# EasyEDA schematic SCH_prototypeCarbon_2025-07-03.json
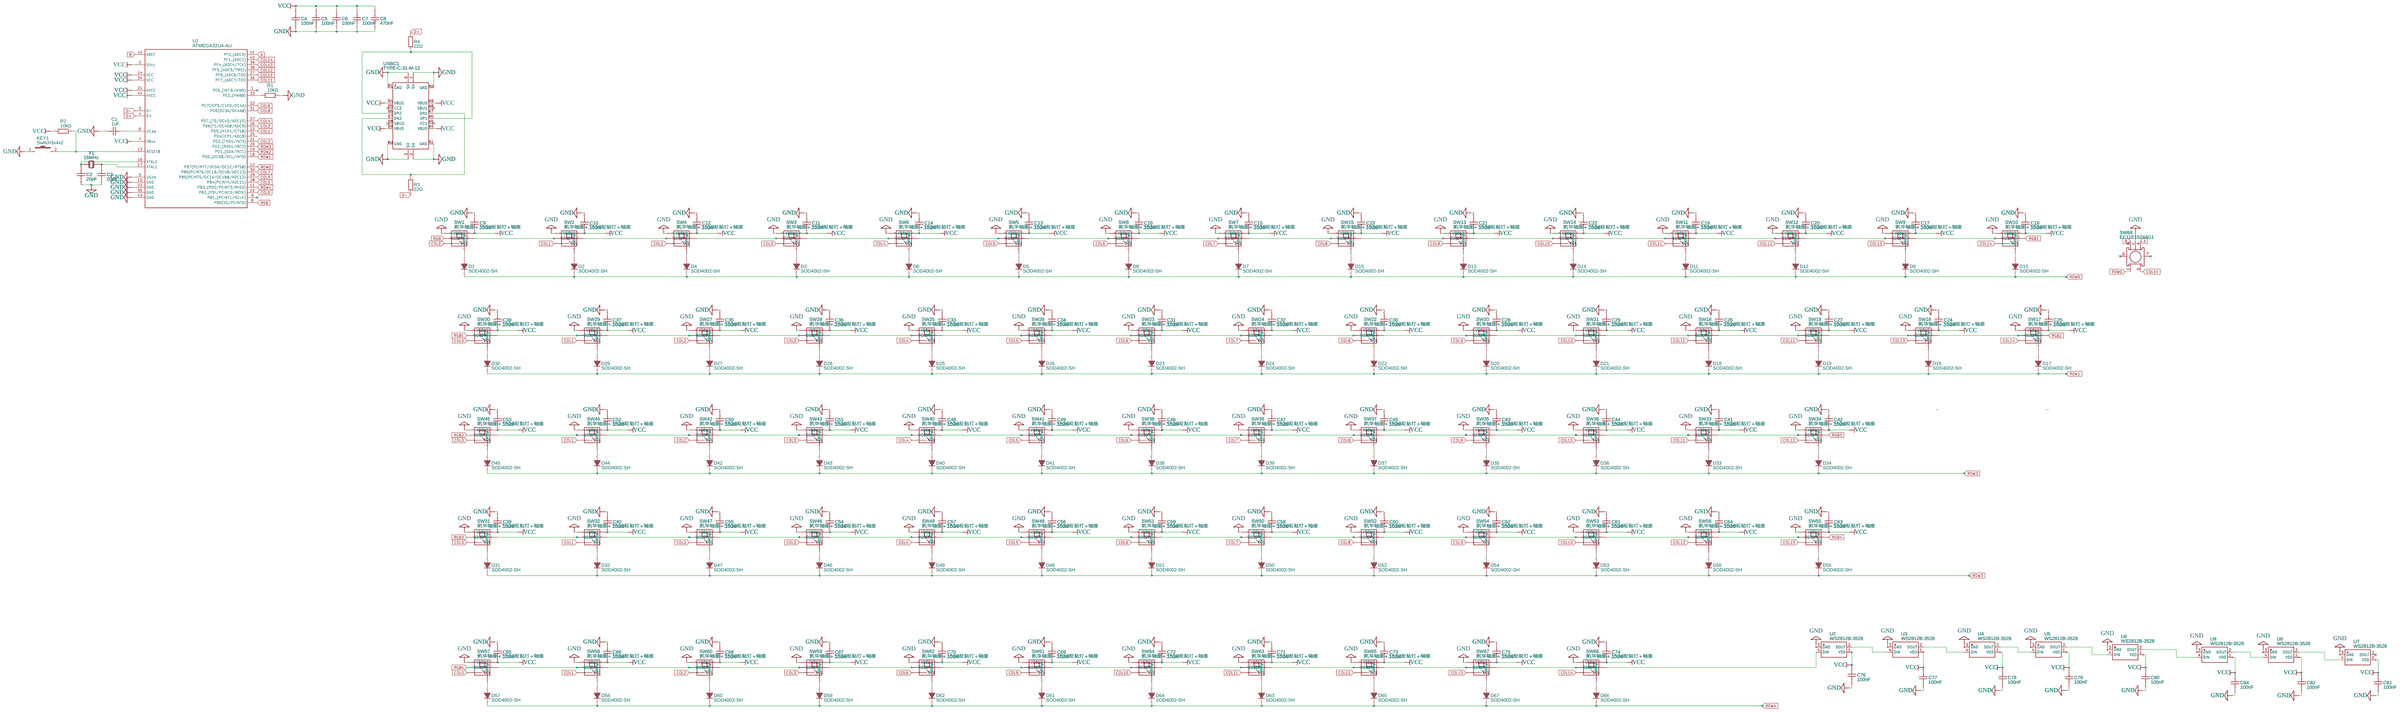
[diagram p0: schematic sheet]

## Parts
C1  1uF  [C0805]
C2  20pF  [C0805]
C3  20pF  [C0805]
C4  100nF  [C0805]
C5  100nF  [C0805]
C6  100nF  [C0805]
C7  100nF  [C0805]
C8  470nF  [C0805]
C9  100nF  [C0805]
C10  100nF  [C0805]
C11  100nF  [C0805]
C12  100nF  [C0805]
C13  100nF  [C0805]
C14  100nF  [C0805]
C15  100nF  [C0805]
C16  100nF  [C0805]
C17  100nF  [C0805]
C18  100nF  [C0805]
C19  100nF  [C0805]
C20  100nF  [C0805]
C21  100nF  [C0805]
C22  100nF  [C0805]
C23  100nF  [C0805]
C24  100nF  [C0805]
C25  100nF  [C0805]
C26  100nF  [C0805]
C27  100nF  [C0805]
C28  100nF  [C0805]
C29  100nF  [C0805]
C30  100nF  [C0805]
C31  100nF  [C0805]
C32  100nF  [C0805]
C33  100nF  [C0805]
C34  100nF  [C0805]
C35  100nF  [C0805]
C36  100nF  [C0805]
C37  100nF  [C0805]
C38  100nF  [C0805]
C39  100nF  [C0805]
C40  100nF  [C0805]
C41  100nF  [C0805]
C42  100nF  [C0805]
C43  100nF  [C0805]
C44  100nF  [C0805]
C45  100nF  [C0805]
C46  100nF  [C0805]
C47  100nF  [C0805]
C48  100nF  [C0805]
C49  100nF  [C0805]
C50  100nF  [C0805]
C51  100nF  [C0805]
C52  100nF  [C0805]
C53  100nF  [C0805]
C54  100nF  [C0805]
C55  100nF  [C0805]
C56  100nF  [C0805]
C57  100nF  [C0805]
C58  100nF  [C0805]
C59  100nF  [C0805]
C60  100nF  [C0805]
C61  100nF  [C0805]
C62  100nF  [C0805]
C63  100nF  [C0805]
C64  100nF  [C0805]
C65  100nF  [C0805]
C66  100nF  [C0805]
C67  100nF  [C0805]
C68  100nF  [C0805]
C69  100nF  [C0805]
C70  100nF  [C0805]
C71  100nF  [C0805]
C72  100nF  [C0805]
C73  100nF  [C0805]
C74  100nF  [C0805]
C75  100nF  [C0805]
C76  100nF  [C0805]
C77  100nF  [C0805]
C78  100nF  [C0805]
C79  100nF  [C0805]
C80  100nF  [C0805]
C81  100nF  [C0805]
C82  100nF  [C0805]
C84  100nF  [C0805]
D1  SOD4002-SH  [SOD-123F_L2.8-W1.8-LS3.7-RD]
D2  SOD4002-SH  [SOD-123F_L2.8-W1.8-LS3.7-RD]
D3  SOD4002-SH  [SOD-123F_L2.8-W1.8-LS3.7-RD]
D4  SOD4002-SH  [SOD-123F_L2.8-W1.8-LS3.7-RD]
D5  SOD4002-SH  [SOD-123F_L2.8-W1.8-LS3.7-RD]
D6  SOD4002-SH  [SOD-123F_L2.8-W1.8-LS3.7-RD]
D7  SOD4002-SH  [SOD-123F_L2.8-W1.8-LS3.7-RD]
D8  SOD4002-SH  [SOD-123F_L2.8-W1.8-LS3.7-RD]
D9  SOD4002-SH  [SOD-123F_L2.8-W1.8-LS3.7-RD]
D10  SOD4002-SH  [SOD-123F_L2.8-W1.8-LS3.7-RD]
D11  SOD4002-SH  [SOD-123F_L2.8-W1.8-LS3.7-RD]
D12  SOD4002-SH  [SOD-123F_L2.8-W1.8-LS3.7-RD]
D13  SOD4002-SH  [SOD-123F_L2.8-W1.8-LS3.7-RD]
D14  SOD4002-SH  [SOD-123F_L2.8-W1.8-LS3.7-RD]
D15  SOD4002-SH  [SOD-123F_L2.8-W1.8-LS3.7-RD]
D16  SOD4002-SH  [SOD-123F_L2.8-W1.8-LS3.7-RD]
D17  SOD4002-SH  [SOD-123F_L2.8-W1.8-LS3.7-RD]
D18  SOD4002-SH  [SOD-123F_L2.8-W1.8-LS3.7-RD]
D19  SOD4002-SH  [SOD-123F_L2.8-W1.8-LS3.7-RD]
D20  SOD4002-SH  [SOD-123F_L2.8-W1.8-LS3.7-RD]
D21  SOD4002-SH  [SOD-123F_L2.8-W1.8-LS3.7-RD]
D22  SOD4002-SH  [SOD-123F_L2.8-W1.8-LS3.7-RD]
D23  SOD4002-SH  [SOD-123F_L2.8-W1.8-LS3.7-RD]
D24  SOD4002-SH  [SOD-123F_L2.8-W1.8-LS3.7-RD]
D25  SOD4002-SH  [SOD-123F_L2.8-W1.8-LS3.7-RD]
D26  SOD4002-SH  [SOD-123F_L2.8-W1.8-LS3.7-RD]
D27  SOD4002-SH  [SOD-123F_L2.8-W1.8-LS3.7-RD]
D28  SOD4002-SH  [SOD-123F_L2.8-W1.8-LS3.7-RD]
D29  SOD4002-SH  [SOD-123F_L2.8-W1.8-LS3.7-RD]
D30  SOD4002-SH  [SOD-123F_L2.8-W1.8-LS3.7-RD]
D31  SOD4002-SH  [SOD-123F_L2.8-W1.8-LS3.7-RD]
D32  SOD4002-SH  [SOD-123F_L2.8-W1.8-LS3.7-RD]
D33  SOD4002-SH  [SOD-123F_L2.8-W1.8-LS3.7-RD]
D34  SOD4002-SH  [SOD-123F_L2.8-W1.8-LS3.7-RD]
D35  SOD4002-SH  [SOD-123F_L2.8-W1.8-LS3.7-RD]
D36  SOD4002-SH  [SOD-123F_L2.8-W1.8-LS3.7-RD]
D37  SOD4002-SH  [SOD-123F_L2.8-W1.8-LS3.7-RD]
D38  SOD4002-SH  [SOD-123F_L2.8-W1.8-LS3.7-RD]
D39  SOD4002-SH  [SOD-123F_L2.8-W1.8-LS3.7-RD]
D40  SOD4002-SH  [SOD-123F_L2.8-W1.8-LS3.7-RD]
D41  SOD4002-SH  [SOD-123F_L2.8-W1.8-LS3.7-RD]
D42  SOD4002-SH  [SOD-123F_L2.8-W1.8-LS3.7-RD]
D43  SOD4002-SH  [SOD-123F_L2.8-W1.8-LS3.7-RD]
D44  SOD4002-SH  [SOD-123F_L2.8-W1.8-LS3.7-RD]
D45  SOD4002-SH  [SOD-123F_L2.8-W1.8-LS3.7-RD]
D46  SOD4002-SH  [SOD-123F_L2.8-W1.8-LS3.7-RD]
D47  SOD4002-SH  [SOD-123F_L2.8-W1.8-LS3.7-RD]
D48  SOD4002-SH  [SOD-123F_L2.8-W1.8-LS3.7-RD]
D49  SOD4002-SH  [SOD-123F_L2.8-W1.8-LS3.7-RD]
D50  SOD4002-SH  [SOD-123F_L2.8-W1.8-LS3.7-RD]
D51  SOD4002-SH  [SOD-123F_L2.8-W1.8-LS3.7-RD]
D52  SOD4002-SH  [SOD-123F_L2.8-W1.8-LS3.7-RD]
D53  SOD4002-SH  [SOD-123F_L2.8-W1.8-LS3.7-RD]
D54  SOD4002-SH  [SOD-123F_L2.8-W1.8-LS3.7-RD]
D55  SOD4002-SH  [SOD-123F_L2.8-W1.8-LS3.7-RD]
D56  SOD4002-SH  [SOD-123F_L2.8-W1.8-LS3.7-RD]
D57  SOD4002-SH  [SOD-123F_L2.8-W1.8-LS3.7-RD]
D58  SOD4002-SH  [SOD-123F_L2.8-W1.8-LS3.7-RD]
D59  SOD4002-SH  [SOD-123F_L2.8-W1.8-LS3.7-RD]
D60  SOD4002-SH  [SOD-123F_L2.8-W1.8-LS3.7-RD]
D61  SOD4002-SH  [SOD-123F_L2.8-W1.8-LS3.7-RD]
D62  SOD4002-SH  [SOD-123F_L2.8-W1.8-LS3.7-RD]
D63  SOD4002-SH  [SOD-123F_L2.8-W1.8-LS3.7-RD]
D64  SOD4002-SH  [SOD-123F_L2.8-W1.8-LS3.7-RD]
D65  SOD4002-SH  [SOD-123F_L2.8-W1.8-LS3.7-RD]
D66  SOD4002-SH  [SOD-123F_L2.8-W1.8-LS3.7-RD]
D67  SOD4002-SH  [SOD-123F_L2.8-W1.8-LS3.7-RD]
KEY1  Switch3x4x2  [SW-SMD_L4.0-W2.9-LS5.0]
R1  10kΩ  [R0805]
R2  10kΩ  [R0805]
R3  22Ω  [R0805]
R4  22Ω  [R0805]
SW1  凯华轴座+3528反贴灯+轴座  [凯华轴座+3528反贴灯]
SW2  凯华轴座+3528反贴灯+轴座  [凯华轴座+3528反贴灯]
SW3  凯华轴座+3528反贴灯+轴座  [凯华轴座+3528反贴灯]
SW4  凯华轴座+3528反贴灯+轴座  [凯华轴座+3528反贴灯]
SW5  凯华轴座+3528反贴灯+轴座  [凯华轴座+3528反贴灯]
SW6  凯华轴座+3528反贴灯+轴座  [凯华轴座+3528反贴灯]
SW7  凯华轴座+3528反贴灯+轴座  [凯华轴座+3528反贴灯]
SW8  凯华轴座+3528反贴灯+轴座  [凯华轴座+3528反贴灯]
SW9  凯华轴座+3528反贴灯+轴座  [凯华轴座+3528反贴灯]
SW10  凯华轴座+3528反贴灯+轴座  [凯华轴座+3528反贴灯]
SW11  凯华轴座+3528反贴灯+轴座  [凯华轴座+3528反贴灯]
SW12  凯华轴座+3528反贴灯+轴座  [凯华轴座+3528反贴灯]
SW13  凯华轴座+3528反贴灯+轴座  [凯华轴座+3528反贴灯]
SW14  凯华轴座+3528反贴灯+轴座  [凯华轴座+3528反贴灯]
SW15  凯华轴座+3528反贴灯+轴座  [凯华轴座+3528反贴灯]
SW16  凯华轴座+3528反贴灯+轴座  [凯华轴座+3528反贴灯]
SW17  凯华轴座+3528反贴灯+轴座  [凯华轴座+3528反贴灯]
SW18  凯华轴座+3528反贴灯+轴座  [凯华轴座+3528反贴灯]
SW19  凯华轴座+3528反贴灯+轴座  [凯华轴座+3528反贴灯]
SW20  凯华轴座+3528反贴灯+轴座  [凯华轴座+3528反贴灯]
SW21  凯华轴座+3528反贴灯+轴座  [凯华轴座+3528反贴灯]
SW22  凯华轴座+3528反贴灯+轴座  [凯华轴座+3528反贴灯]
SW23  凯华轴座+3528反贴灯+轴座  [凯华轴座+3528反贴灯]
SW24  凯华轴座+3528反贴灯+轴座  [凯华轴座+3528反贴灯]
SW25  凯华轴座+3528反贴灯+轴座  [凯华轴座+3528反贴灯]
SW26  凯华轴座+3528反贴灯+轴座  [凯华轴座+3528反贴灯]
SW27  凯华轴座+3528反贴灯+轴座  [凯华轴座+3528反贴灯]
SW28  凯华轴座+3528反贴灯+轴座  [凯华轴座+3528反贴灯]
SW29  凯华轴座+3528反贴灯+轴座  [凯华轴座+3528反贴灯]
SW30  凯华轴座+3528反贴灯+轴座  [凯华轴座+3528反贴灯]
SW31  凯华轴座+3528反贴灯+轴座  [凯华轴座+3528反贴灯]
SW32  凯华轴座+3528反贴灯+轴座  [凯华轴座+3528反贴灯]
SW33  凯华轴座+3528反贴灯+轴座  [凯华轴座+3528反贴灯]
SW34  凯华轴座+3528反贴灯+轴座  [凯华轴座+3528反贴灯]
SW35  凯华轴座+3528反贴灯+轴座  [凯华轴座+3528反贴灯]
SW36  凯华轴座+3528反贴灯+轴座  [凯华轴座+3528反贴灯]
SW37  凯华轴座+3528反贴灯+轴座  [凯华轴座+3528反贴灯]
SW38  凯华轴座+3528反贴灯+轴座  [凯华轴座+3528反贴灯]
SW39  凯华轴座+3528反贴灯+轴座  [凯华轴座+3528反贴灯]
SW40  凯华轴座+3528反贴灯+轴座  [凯华轴座+3528反贴灯]
SW41  凯华轴座+3528反贴灯+轴座  [凯华轴座+3528反贴灯]
SW42  凯华轴座+3528反贴灯+轴座  [凯华轴座+3528反贴灯]
SW43  凯华轴座+3528反贴灯+轴座  [凯华轴座+3528反贴灯]
SW44  凯华轴座+3528反贴灯+轴座  [凯华轴座+3528反贴灯]
SW45  凯华轴座+3528反贴灯+轴座  [凯华轴座+3528反贴灯]
SW46  凯华轴座+3528反贴灯+轴座  [凯华轴座+3528反贴灯]
SW47  凯华轴座+3528反贴灯+轴座  [凯华轴座+3528反贴灯]
SW48  凯华轴座+3528反贴灯+轴座  [凯华轴座+3528反贴灯]
SW49  凯华轴座+3528反贴灯+轴座  [凯华轴座+3528反贴灯]
SW50  凯华轴座+3528反贴灯+轴座  [凯华轴座+3528反贴灯]
SW51  凯华轴座+3528反贴灯+轴座  [凯华轴座+3528反贴灯]
SW52  凯华轴座+3528反贴灯+轴座  [凯华轴座+3528反贴灯]
SW53  凯华轴座+3528反贴灯+轴座  [凯华轴座+3528反贴灯]
SW54  凯华轴座+3528反贴灯+轴座  [凯华轴座+3528反贴灯]
SW55  凯华轴座+3528反贴灯+轴座  [凯华轴座+3528反贴灯]
SW56  凯华轴座+3528反贴灯+轴座  [凯华轴座+3528反贴灯]
SW57  凯华轴座+3528反贴灯+轴座  [凯华轴座+3528反贴灯]
SW58  凯华轴座+3528反贴灯+轴座  [凯华轴座+3528反贴灯]
SW59  凯华轴座+3528反贴灯+轴座  [凯华轴座+3528反贴灯]
SW60  凯华轴座+3528反贴灯+轴座  [凯华轴座+3528反贴灯]
SW61  凯华轴座+3528反贴灯+轴座  [凯华轴座+3528反贴灯]
SW62  凯华轴座+3528反贴灯+轴座  [凯华轴座+3528反贴灯]
SW63  凯华轴座+3528反贴灯+轴座  [凯华轴座+3528反贴灯]
SW64  凯华轴座+3528反贴灯+轴座  [凯华轴座+3528反贴灯]
SW65  凯华轴座+3528反贴灯+轴座  [凯华轴座+3528反贴灯]
SW66  凯华轴座+3528反贴灯+轴座  [凯华轴座+3528反贴灯]
SW67  凯华轴座+3528反贴灯+轴座  [凯华轴座+3528反贴灯]
SW68  EC11E15244G1  [SW-TH_EC11E15244G1GAI]
U1  ATMEGA32U4-AU  [QFP-44_L10.0-W10.0-P0.80-LS13.2-BL]
U2  WS2812B-3528  [WS2812B-3528]
U3  WS2812B-3528  [WS2812B-3528]
U4  WS2812B-3528  [WS2812B-3528]
U5  WS2812B-3528  [WS2812B-3528]
U6  WS2812B-3528  [WS2812B-3528]
U7  WS2812B-3528  [WS2812B-3528]
U8  WS2812B-3528  [WS2812B-3528]
U9  WS2812B-3528  [WS2812B-3528]
USBC1  TYPE-C-31-M-12  [USB-C_SMD-TYPE-C-31-M-12]
X1  16MHz  [OSC-SMD_2P-L5.0-W3.2]

## Library data of the parts
C1 = TCC0805X7R105K250FTA: Contributor: LCSC; Supplier: LCSC; Supplier Part: C282735; Manufacturer: CCTC(三环); JLCPCB Part Class: Extended Part
C2 C3 = CC0805JRNPO0BN200: Contributor: LCSC; Supplier: LCSC; Supplier Part: C326845; Manufacturer: YAGEO(国巨); JLCPCB Part Class: Extended Part
C4-C7 C9-C82 C84 = CC0805KRX7R7BB104: Contributor: LCSC; Supplier: LCSC; Supplier Part: C519980; Manufacturer: YAGEO(国巨); JLCPCB Part Class: Extended Part
C8 = CC0805KKX7R0BB474: Contributor: LCSC; Supplier: LCSC; Supplier Part: C596323; Manufacturer: YAGEO(国巨); JLCPCB Part Class: Extended Part
D1-D67 = SOD4002-SH: Contributor: LCSC; Supplier: LCSC; Manufacturer: LRC(乐山无线电); Supplier Part: C154996; JLCPCB Part Class: Extended Part
KEY1 = Switch3x4x2: Supplier: LCSC; Manufacturer: 国产; Manufacturer Part: 轻触开关3x4x2; Supplier Part: C26638; JLCPCB Part Class: Extended Part
R1 R2 = AF0805FR-0710KL: Contributor: LCSC; Supplier: LCSC; Supplier Part: C192906; Manufacturer: YAGEO(国巨); JLCPCB Part Class: Extended Part
R3 R4 = RT0805WRC0722RL: Contributor: lcsc; Supplier: LCSC; Supplier Part: C1724067; Manufacturer: YAGEO(国巨); JLCPCB Part Class: Extended Part
SW1-SW67 = 凯华轴座+3528反贴灯+轴座: Contributor: Yi_Tong_Yuan
SW68 = EC11E15244G1: Contributor: LCSC; Supplier: LCSC; Supplier Part: C370970; Manufacturer: ALPSALPINE(阿尔卑斯阿尔派); JLCPCB Part Class: Extended Part
U1 = ATMEGA32U4-AU: Supplier: LCSC; Manufacturer: MICROCHIP(美国微芯); Supplier Part: C44854; JLCPCB Part Class: Extended Part
U2-U9 = WS2812B-3528: Contributor: gcvgv
USBC1 = TYPE-C-31-M-12: Contributor: LCSC; Supplier: LCSC; Supplier Part: C165948; Manufacturer: 韩国韩荣; JLCPCB Part Class: Extended Part
X1 = XSHEELNANF-16MHZ: Contributor: LCSC; Supplier: LCSC; Supplier Part: C242221; Manufacturer: TAITIEN(泰艺电子); JLCPCB Part Class: Extended Part

## Nets
GND: C1.2 C2.2 C3.2 C4.2 C5.2 C6.2 C7.2 C8.1 C9.2 C10.2 C11.2 C12.2 C13.2 C14.2 C15.2 C16.2 C17.2 C18.2 C19.2 C20.2 C21.2 C22.2 C23.2 C24.2 C25.2 C26.2 C27.2 C28.2 C29.2 C30.2 C31.2 C32.2 C33.2 C34.2 C35.2 C36.2 C37.2 C38.2 C39.2 C40.2 C41.2 C42.2 C43.2 C44.2 C45.2 C46.2 C47.2 C48.2 C49.2 C50.2 C51.2 C52.2 C53.2 C54.2 C55.2 C56.2 C57.2 C58.2 C59.2 C60.2 C61.2 C62.2 C63.2 C64.2 C65.2 C66.2 C67.2 C68.2 C69.2 C70.2 C71.2 C72.2 C73.2 C74.2 C75.2 C76.1 C77.1 C78.1 C79.1 C80.1 C81.1 C82.1 C84.1 KEY1.1 R1.2 SW1.GND SW2.GND SW3.GND SW4.GND SW5.GND SW6.GND SW7.GND SW8.GND SW9.GND SW10.GND SW11.GND SW12.GND SW13.GND SW14.GND SW15.GND SW16.GND SW17.GND SW18.GND SW19.GND SW20.GND SW21.GND SW22.GND SW23.GND SW24.GND SW25.GND SW26.GND SW27.GND SW28.GND SW29.GND SW30.GND SW31.GND SW32.GND SW33.GND SW34.GND SW35.GND SW36.GND SW37.GND SW38.GND SW39.GND SW40.GND SW41.GND SW42.GND SW43.GND SW44.GND SW45.GND SW46.GND SW47.GND SW48.GND SW49.GND SW50.GND SW51.GND SW52.GND SW53.GND SW54.GND SW55.GND SW56.GND SW57.GND SW58.GND SW59.GND SW60.GND SW61.GND SW62.GND SW63.GND SW64.GND SW65.GND SW66.GND SW67.GND SW68.C U1.5(UGnd) U1.15(GND) U1.23(GND) U1.35(GND) U1.43(GND) U2.3(GND) U3.3(GND) U4.3(GND) U5.3(GND) U6.3(GND) U7.3(GND) U8.3(GND) U9.3(GND) USBC1.0(SH) USBC1.1(SH) USBC1.2(SH) USBC1.3(SH) USBC1.A1(GND) USBC1.A12(GND) USBC1.B1(GND) USBC1.B12(GND)
VCC: C4.1 C5.1 C6.1 C7.1 C8.2 C9.1 C10.1 C11.1 C12.1 C13.1 C14.1 C15.1 C16.1 C17.1 C18.1 C19.1 C20.1 C21.1 C22.1 C23.1 C24.1 C25.1 C26.1 C27.1 C28.1 C29.1 C30.1 C31.1 C32.1 C33.1 C34.1 C35.1 C36.1 C37.1 C38.1 C39.1 C40.1 C41.1 C42.1 C43.1 C44.1 C45.1 C46.1 C47.1 C48.1 C49.1 C50.1 C51.1 C52.1 C53.1 C54.1 C55.1 C56.1 C57.1 C58.1 C59.1 C60.1 C61.1 C62.1 C63.1 C64.1 C65.1 C66.1 C67.1 C68.1 C69.1 C70.1 C71.1 C72.1 C73.1 C74.1 C75.1 C76.2 C77.2 C78.2 C79.2 C80.2 C81.2 C82.2 C84.2 R2.1 SW1.VDD SW2.VDD SW3.VDD SW4.VDD SW5.VDD SW6.VDD SW7.VDD SW8.VDD SW9.VDD SW10.VDD SW11.VDD SW12.VDD SW13.VDD SW14.VDD SW15.VDD SW16.VDD SW17.VDD SW18.VDD SW19.VDD SW20.VDD SW21.VDD SW22.VDD SW23.VDD SW24.VDD SW25.VDD SW26.VDD SW27.VDD SW28.VDD SW29.VDD SW30.VDD SW31.VDD SW32.VDD SW33.VDD SW34.VDD SW35.VDD SW36.VDD SW37.VDD SW38.VDD SW39.VDD SW40.VDD SW41.VDD SW42.VDD SW43.VDD SW44.VDD SW45.VDD SW46.VDD SW47.VDD SW48.VDD SW49.VDD SW50.VDD SW51.VDD SW52.VDD SW53.VDD SW54.VDD SW55.VDD SW56.VDD SW57.VDD SW58.VDD SW59.VDD SW60.VDD SW61.VDD SW62.VDD SW63.VDD SW64.VDD SW65.VDD SW66.VDD SW67.VDD U1.2(UVcc) U1.7(VBus) U1.14(VCC) U1.24(AVCC) U1.34(VCC) U1.44(AVCC) U2.1(VDD) U3.1(VDD) U4.1(VDD) U5.1(VDD) U6.1(VDD) U7.1(VDD) U8.1(VDD) U9.1(VDD) USBC1.A4(VBUS) USBC1.A9(VBUS) USBC1.B4(VBUS) USBC1.B9(VBUS)
A: SW68.A U1.41(PF0 (ADC0))
B: SW68.B U1.42(AREF)
COL0: SW1.COL SW30.COL SW31.COL SW45.COL SW57.COL U1.10(PB2 (PDI/PCINT2/MOSI))
COL1: SW2.COL SW29.COL SW32.COL SW44.COL SW58.COL U1.22(PD5 (XCK1/CTS#))
COL2: SW4.COL SW27.COL SW42.COL SW47.COL SW60.COL U1.21(PD3 (TXD1/INT3))
COL3: SW3.COL SW28.COL SW43.COL SW46.COL SW59.COL U1.26(PD6(T1/OC4D#/ADC9))
COL4: SW6.COL SW25.COL SW40.COL SW49.COL U1.27(PD7 (T0/OC4D/ADC10))
COL5: SW5.COL SW26.COL SW41.COL SW48.COL U1.28(PB4(PCINT4/ADC11))
COL6: SW8.COL SW23.COL SW38.COL SW51.COL SW62.COL U1.32(PC7(ICP3/CLK0/OC4A))
COL7: SW7.COL SW24.COL SW39.COL SW50.COL U1.30(PB6(PCINT6/OC1B/OC4B/ADC13))
COL8: SW15.COL SW22.COL SW37.COL SW52.COL U1.31(PC6(OC3A/OC4A#))
COL9: SW13.COL SW20.COL SW35.COL SW54.COL SW61.COL U1.29(PB5(PCINT5/OC1A/OC4B#/ADC12))
COL10: SW14.COL SW21.COL SW36.COL SW53.COL SW64.COL U1.37(PF6 (ADC6/TDO)
COL11: SW11.COL SW18.COL SW33.COL SW63.COL U1.36(PF7 (ADC7/TDI))
COL12: SW12.COL SW19.COL SW34.COL SW56.COL SW65.COL U1.38(PF5 (ADC5/TMS)))
COL13: SW9.COL SW16.COL SW55.COL SW67.COL U1.39(PF4 (ADC4/TCK))
COL14: SW10.COL SW17.COL SW66.COL SW68.D U1.40(PF1 (ADC1))
D+: R4.2 U1.4(D+)
D-: R3.1 U1.3(D-)
RGB: SW1.DIN U1.8(PB0(SS/PCINT0))
RGB1: SW10.DOUT SW30.DIN
RGB2: SW17.DOUT SW45.DIN
RGB3: SW31.DIN SW34.DOUT
RGB4: SW55.DOUT SW57.DIN
ROW0: D1.1(K) D2.1(K) D3.1(K) D4.1(K) D5.1(K) D6.1(K) D7.1(K) D8.1(K) D9.1(K) D10.1(K) D11.1(K) D12.1(K) D13.1(K) D14.1(K) D15.1(K) SW68.E U1.12(PB7(PCINT7/OC0A/OC1C/RTS#))
ROW1: D16.1(K) D17.1(K) D18.1(K) D19.1(K) D20.1(K) D21.1(K) D22.1(K) D23.1(K) D24.1(K) D25.1(K) D26.1(K) D27.1(K) D28.1(K) D29.1(K) D30.1(K) U1.18(PD0 (OC0B/SCL/INT0))
ROW2: D33.1(K) D34.1(K) D35.1(K) D36.1(K) D37.1(K) D38.1(K) D39.1(K) D40.1(K) D41.1(K) D42.1(K) D43.1(K) D44.1(K) D45.1(K) U1.19(PD1 (SDA/INT1))
ROW3: D31.1(K) D32.1(K) D46.1(K) D47.1(K) D48.1(K) D49.1(K) D50.1(K) D51.1(K) D52.1(K) D53.1(K) D54.1(K) D55.1(K) D56.1(K) U1.20(PD2 (RXD1/INT2))
ROW4: D57.1(K) D58.1(K) D59.1(K) D60.1(K) D61.1(K) D62.1(K) D63.1(K) D64.1(K) D65.1(K) D66.1(K) D67.1(K) U1.11(PB3 (PDO/PCINT3/MISO))
Net-(C1-1): C1.1 U1.6(UCap)
Net-(C2-1): C2.1 U1.16(XTAL2) X1.1(OSC1)
Net-(C3-1): C3.1 U1.17(XTAL1) X1.2(OSC2)
Net-(D1-2): D1.2(A) SW1.ROW
Net-(D2-2): D2.2(A) SW2.ROW
Net-(D3-2): D3.2(A) SW3.ROW
Net-(D4-2): D4.2(A) SW4.ROW
Net-(D5-2): D5.2(A) SW5.ROW
Net-(D6-2): D6.2(A) SW6.ROW
Net-(D7-2): D7.2(A) SW7.ROW
Net-(D8-2): D8.2(A) SW8.ROW
Net-(D9-2): D9.2(A) SW9.ROW
Net-(D10-2): D10.2(A) SW10.ROW
Net-(D11-2): D11.2(A) SW11.ROW
Net-(D12-2): D12.2(A) SW12.ROW
Net-(D13-2): D13.2(A) SW13.ROW
Net-(D14-2): D14.2(A) SW14.ROW
Net-(D15-2): D15.2(A) SW15.ROW
Net-(D16-2): D16.2(A) SW16.ROW
Net-(D17-2): D17.2(A) SW17.ROW
Net-(D18-2): D18.2(A) SW18.ROW
Net-(D19-2): D19.2(A) SW19.ROW
Net-(D20-2): D20.2(A) SW20.ROW
Net-(D21-2): D21.2(A) SW21.ROW
Net-(D22-2): D22.2(A) SW22.ROW
Net-(D23-2): D23.2(A) SW23.ROW
Net-(D24-2): D24.2(A) SW24.ROW
Net-(D25-2): D25.2(A) SW25.ROW
Net-(D26-2): D26.2(A) SW26.ROW
Net-(D27-2): D27.2(A) SW27.ROW
Net-(D28-2): D28.2(A) SW28.ROW
Net-(D29-2): D29.2(A) SW29.ROW
Net-(D30-2): D30.2(A) SW30.ROW
Net-(D31-2): D31.2(A) SW31.ROW
Net-(D32-2): D32.2(A) SW32.ROW
Net-(D33-2): D33.2(A) SW33.ROW
Net-(D34-2): D34.2(A) SW34.ROW
Net-(D35-2): D35.2(A) SW35.ROW
Net-(D36-2): D36.2(A) SW36.ROW
Net-(D37-2): D37.2(A) SW37.ROW
Net-(D38-2): D38.2(A) SW38.ROW
Net-(D39-2): D39.2(A) SW39.ROW
Net-(D40-2): D40.2(A) SW40.ROW
Net-(D41-2): D41.2(A) SW41.ROW
Net-(D42-2): D42.2(A) SW42.ROW
Net-(D43-2): D43.2(A) SW43.ROW
Net-(D44-2): D44.2(A) SW44.ROW
Net-(D45-2): D45.2(A) SW45.ROW
Net-(D46-2): D46.2(A) SW46.ROW
Net-(D47-2): D47.2(A) SW47.ROW
Net-(D48-2): D48.2(A) SW48.ROW
Net-(D49-2): D49.2(A) SW49.ROW
Net-(D50-2): D50.2(A) SW50.ROW
Net-(D51-2): D51.2(A) SW51.ROW
Net-(D52-2): D52.2(A) SW52.ROW
Net-(D53-2): D53.2(A) SW53.ROW
Net-(D54-2): D54.2(A) SW54.ROW
Net-(D55-2): D55.2(A) SW55.ROW
Net-(D56-2): D56.2(A) SW56.ROW
Net-(D57-2): D57.2(A) SW57.ROW
Net-(D58-2): D58.2(A) SW58.ROW
Net-(D59-2): D59.2(A) SW59.ROW
Net-(D60-2): D60.2(A) SW60.ROW
Net-(D61-2): D61.2(A) SW61.ROW
Net-(D62-2): D62.2(A) SW62.ROW
Net-(D63-2): D63.2(A) SW63.ROW
Net-(D64-2): D64.2(A) SW64.ROW
Net-(D65-2): D65.2(A) SW65.ROW
Net-(D66-2): D66.2(A) SW66.ROW
Net-(D67-2): D67.2(A) SW67.ROW
Net-(KEY1-2): KEY1.2 R2.2 U1.13(RESET#)
Net-(R1-1): R1.1 U1.33(PE2 (HWB#))
Net-(R3-2): R3.2 USBC1.A7(DN1) USBC1.B7(DN2)
Net-(R4-1): R4.1 USBC1.A6(DP1) USBC1.B6(DP2)
Net-(SW1-DOUT): SW1.DOUT SW2.DIN
Net-(SW2-DOUT): SW2.DOUT SW4.DIN
Net-(SW3-DIN): SW3.DIN SW4.DOUT
Net-(SW3-DOUT): SW3.DOUT SW6.DIN
Net-(SW5-DIN): SW5.DIN SW6.DOUT
Net-(SW5-DOUT): SW5.DOUT SW8.DIN
Net-(SW7-DIN): SW7.DIN SW8.DOUT
Net-(SW7-DOUT): SW7.DOUT SW15.DIN
Net-(SW9-DIN): SW9.DIN SW12.DOUT
Net-(SW9-DOUT): SW9.DOUT SW10.DIN
Net-(SW11-DIN): SW11.DIN SW14.DOUT
Net-(SW11-DOUT): SW11.DOUT SW12.DIN
Net-(SW13-DIN): SW13.DIN SW15.DOUT
Net-(SW13-DOUT): SW13.DOUT SW14.DIN
Net-(SW16-DIN): SW16.DIN SW19.DOUT
Net-(SW16-DOUT): SW16.DOUT SW17.DIN
Net-(SW18-DIN): SW18.DIN SW21.DOUT
Net-(SW18-DOUT): SW18.DOUT SW19.DIN
Net-(SW20-DIN): SW20.DIN SW22.DOUT
Net-(SW20-DOUT): SW20.DOUT SW21.DIN
Net-(SW22-DIN): SW22.DIN SW24.DOUT
Net-(SW23-DIN): SW23.DIN SW26.DOUT
Net-(SW23-DOUT): SW23.DOUT SW24.DIN
Net-(SW25-DIN): SW25.DIN SW28.DOUT
Net-(SW25-DOUT): SW25.DOUT SW26.DIN
Net-(SW27-DIN): SW27.DIN SW29.DOUT
Net-(SW27-DOUT): SW27.DOUT SW28.DIN
Net-(SW29-DIN): SW29.DIN SW30.DOUT
Net-(SW31-DOUT): SW31.DOUT SW32.DIN
Net-(SW32-DOUT): SW32.DOUT SW47.DIN
Net-(SW33-DIN): SW33.DIN SW36.DOUT
Net-(SW33-DOUT): SW33.DOUT SW34.DIN
Net-(SW35-DIN): SW35.DIN SW37.DOUT
Net-(SW35-DOUT): SW35.DOUT SW36.DIN
Net-(SW37-DIN): SW37.DIN SW39.DOUT
Net-(SW38-DIN): SW38.DIN SW41.DOUT
Net-(SW38-DOUT): SW38.DOUT SW39.DIN
Net-(SW40-DIN): SW40.DIN SW43.DOUT
Net-(SW40-DOUT): SW40.DOUT SW41.DIN
Net-(SW42-DIN): SW42.DIN SW44.DOUT
Net-(SW42-DOUT): SW42.DOUT SW43.DIN
Net-(SW44-DIN): SW44.DIN SW45.DOUT
Net-(SW46-DIN): SW46.DIN SW47.DOUT
Net-(SW46-DOUT): SW46.DOUT SW49.DIN
Net-(SW48-DIN): SW48.DIN SW49.DOUT
Net-(SW48-DOUT): SW48.DOUT SW51.DIN
Net-(SW50-DIN): SW50.DIN SW51.DOUT
Net-(SW50-DOUT): SW50.DOUT SW52.DIN
Net-(SW52-DOUT): SW52.DOUT SW54.DIN
Net-(SW53-DIN): SW53.DIN SW54.DOUT
Net-(SW53-DOUT): SW53.DOUT SW56.DIN
Net-(SW55-DIN): SW55.DIN SW56.DOUT
Net-(SW57-DOUT): SW57.DOUT SW58.DIN
Net-(SW58-DOUT): SW58.DOUT SW60.DIN
Net-(SW59-DIN): SW59.DIN SW60.DOUT
Net-(SW59-DOUT): SW59.DOUT SW62.DIN
Net-(SW61-DIN): SW61.DIN SW62.DOUT
Net-(SW61-DOUT): SW61.DOUT SW64.DIN
Net-(SW63-DIN): SW63.DIN SW64.DOUT
Net-(SW63-DOUT): SW63.DOUT SW65.DIN
Net-(SW65-DOUT): SW65.DOUT SW67.DIN
Net-(SW66-DIN): SW66.DIN SW67.DOUT
Net-(SW66-DOUT): SW66.DOUT U2.4(DIN)
Net-(U2-2): U2.2(DOUT) U3.4(DIN)
Net-(U3-2): U3.2(DOUT) U4.4(DIN)
Net-(U4-2): U4.2(DOUT) U5.4(DIN)
Net-(U5-2): U5.2(DOUT) U6.4(DIN)
Net-(U6-2): U6.2(DOUT) U9.4(DIN)
Net-(U7-4): U7.4(DIN) U8.2(DOUT)
Net-(U8-4): U8.4(DIN) U9.2(DOUT)

Not connected (* = marked no-connect by the designer): SW68 6* 7*; U1 1(PE6 (INT.6/AIN0))* 9(PB1 (PCINT1/SCLK))* 25(PD4(ICP1/ADC8)); U7 2(DOUT)*; USBC1 A5(CC1)* A8(SBU1)* B5(CC2)* B8(SBU2)*
